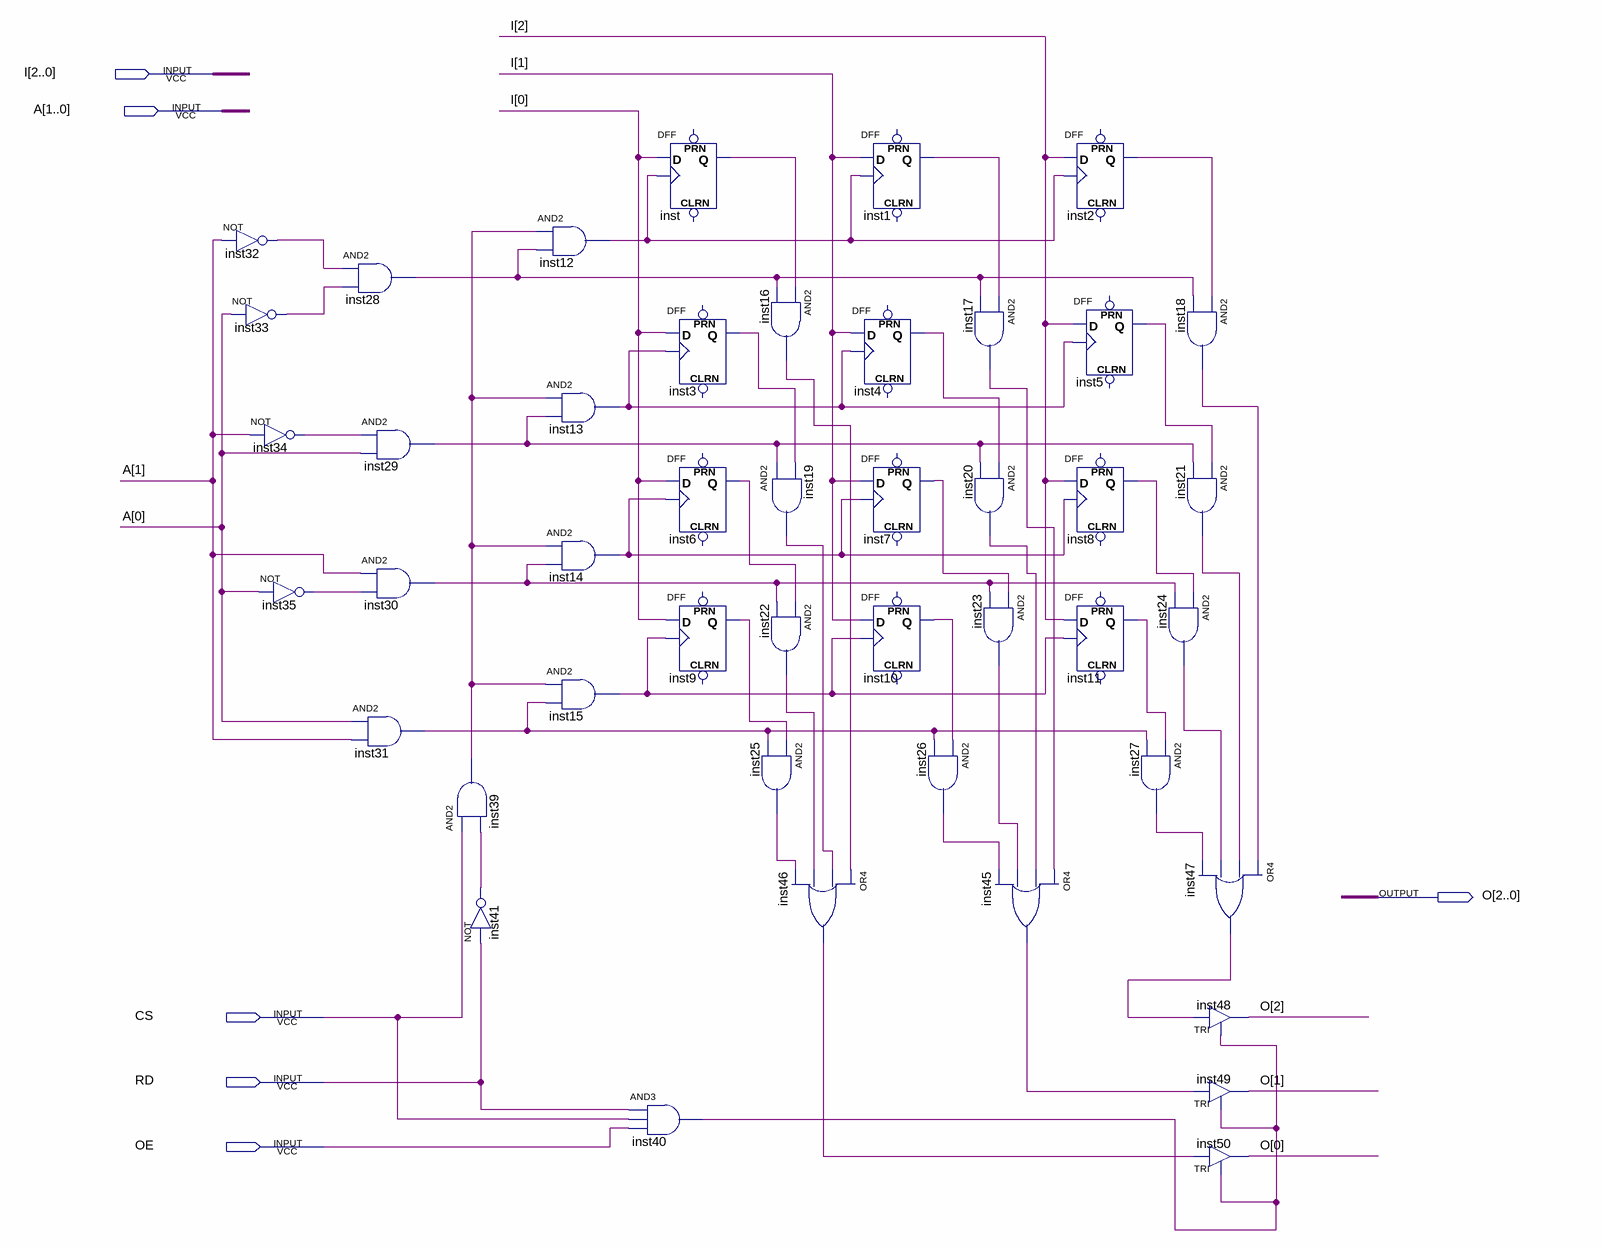
[diagram p0: schematic sheet]
// Quartus schematic MEMORY.bdf as structural Verilog: 45 symbols, 6 pins
module MEMORY (
  input  [2:0] I,
  input  [1:0] A,
  input  CS,
  input  RD,
  input  OE,
  output [2:0] O
);

  wire inst1_q, inst2_q, inst3_q, inst4_q, inst5_q, inst6_q, inst7_q, inst8_q, inst9_q, inst10_q, inst11_q,
       inst12_out, inst13_out, inst14_out, inst15_out, inst16_out, inst17_out, inst18_out, inst19_out,
       inst20_out, inst21_out, inst22_out, inst23_out, inst24_out, inst25_out, inst26_out, inst27_out,
       inst28_out, inst29_out, inst30_out, inst31_out, inst32_out, inst33_out, inst34_out, inst35_out,
       inst39_out, inst40_out, inst41_out, inst45_out, inst46_out, inst47_out, inst_q;

  not inst32 (inst32_out, A[1]);
  not inst33 (inst33_out, A[0]);
  not inst34 (inst34_out, A[1]);
  not inst35 (inst35_out, A[0]);
  and inst28 (inst28_out, inst32_out, inst33_out);
  and inst29 (inst29_out, inst34_out, A[0]);
  and inst30 (inst30_out, A[1], inst35_out);
  and inst31 (inst31_out, A[0], A[1]);
  and inst39 (inst39_out, CS, inst41_out);
  not inst41 (inst41_out, RD);
  and inst12 (inst12_out, inst39_out, inst28_out);
  and inst13 (inst13_out, inst39_out, inst29_out);
  and inst14 (inst14_out, inst39_out, inst30_out);
  and inst15 (inst15_out, inst39_out, inst31_out);
  and inst40 (inst40_out, RD, CS, OE);
  DFF inst (.CLK(inst12_out), .D(I[0]), .Q(inst_q));  // open: CLRN, PRN
  DFF inst3 (.CLK(inst13_out), .D(I[0]), .Q(inst3_q));  // open: CLRN, PRN
  DFF inst6 (.CLK(inst14_out), .D(I[0]), .Q(inst6_q));  // open: CLRN, PRN
  DFF inst9 (.CLK(inst15_out), .D(I[0]), .Q(inst9_q));  // open: CLRN, PRN
  and inst16 (inst16_out, inst_q, inst28_out);
  and inst19 (inst19_out, inst29_out, inst3_q);
  and inst22 (inst22_out, inst6_q, inst30_out);
  and inst25 (inst25_out, inst9_q, inst31_out);
  or inst46 (inst46_out, inst16_out, inst19_out, inst22_out, inst25_out);
  DFF inst4 (.CLK(inst13_out), .D(I[1]), .Q(inst4_q));  // open: CLRN, PRN
  DFF inst1 (.CLK(inst12_out), .D(I[1]), .Q(inst1_q));  // open: CLRN, PRN
  DFF inst7 (.CLK(inst14_out), .D(I[1]), .Q(inst7_q));  // open: CLRN, PRN
  DFF inst10 (.CLK(inst15_out), .D(I[1]), .Q(inst10_q));  // open: CLRN, PRN
  and inst26 (inst26_out, inst10_q, inst31_out);
  and inst17 (inst17_out, inst1_q, inst28_out);
  and inst20 (inst20_out, inst4_q, inst29_out);
  and inst23 (inst23_out, inst7_q, inst30_out);
  or inst45 (inst45_out, inst17_out, inst20_out, inst23_out, inst26_out);
  DFF inst2 (.CLK(inst12_out), .D(I[2]), .Q(inst2_q));  // open: CLRN, PRN
  DFF inst5 (.CLK(inst13_out), .D(I[2]), .Q(inst5_q));  // open: CLRN, PRN
  DFF inst8 (.CLK(inst14_out), .D(I[2]), .Q(inst8_q));  // open: CLRN, PRN
  DFF inst11 (.CLK(inst15_out), .D(I[2]), .Q(inst11_q));  // open: CLRN, PRN
  and inst27 (inst27_out, inst11_q, inst31_out);
  and inst18 (inst18_out, inst2_q, inst28_out);
  and inst21 (inst21_out, inst5_q, inst29_out);
  and inst24 (inst24_out, inst8_q, inst30_out);
  or inst47 (inst47_out, inst18_out, inst21_out, inst24_out, inst27_out);
  TRI inst48 (.IN(inst47_out), .OE(inst40_out), .OUT(O[2]));
  TRI inst49 (.IN(inst45_out), .OE(inst40_out), .OUT(O[1]));
  TRI inst50 (.IN(inst46_out), .OE(inst40_out), .OUT(O[0]));
endmodule
